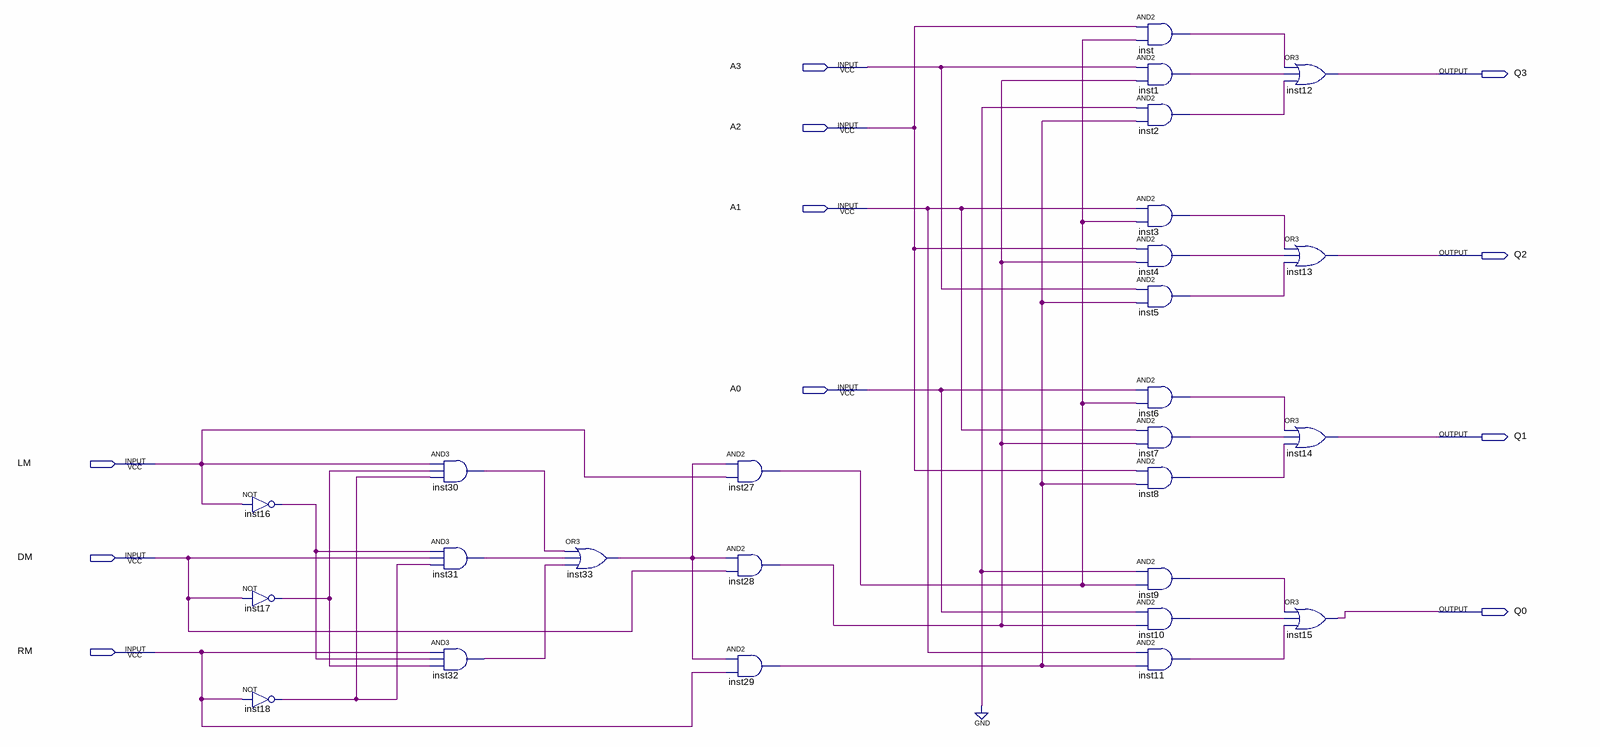
[diagram p0: schematic sheet]
// Quartus schematic shifter-4.bdf as structural Verilog: 26 symbols, 11 pins
module \shifter-4  (
  input  A3,
  input  A2,
  input  A1,
  input  A0,
  input  LM,
  input  DM,
  input  RM,
  output Q3,
  output Q2,
  output Q1,
  output Q0
);

  wire inst1_out, inst2_out, inst3_out, inst4_out, inst5_out, inst6_out, inst7_out, inst8_out, inst9_out,
       inst10_out, inst11_out, inst16_out, inst17_out, inst18_out, inst27_out, inst28_out, inst29_out,
       inst30_out, inst31_out, inst32_out, inst33_out, inst_out;

  not inst16 (inst16_out, LM);
  not inst17 (inst17_out, DM);
  not inst18 (inst18_out, RM);
  and inst30 (inst30_out, LM, inst17_out, inst18_out);
  and inst31 (inst31_out, inst16_out, DM, inst18_out);
  and inst32 (inst32_out, RM, inst16_out, inst17_out);
  or inst33 (inst33_out, inst30_out, inst31_out, inst32_out);
  and inst27 (inst27_out, inst33_out, LM);
  and inst28 (inst28_out, inst33_out, DM);
  and inst29 (inst29_out, inst33_out, RM);
  and inst (inst_out, A2, inst27_out);
  and inst1 (inst1_out, A3, inst28_out);
  and inst2 (inst2_out, 1'b0, inst29_out);
  and inst3 (inst3_out, A1, inst27_out);
  and inst4 (inst4_out, A2, inst28_out);
  and inst5 (inst5_out, A3, inst29_out);
  and inst6 (inst6_out, A0, inst27_out);
  and inst7 (inst7_out, A1, inst28_out);
  and inst8 (inst8_out, A2, inst29_out);
  and inst9 (inst9_out, 1'b0, inst27_out);
  and inst10 (inst10_out, A0, inst28_out);
  and inst11 (inst11_out, A1, inst29_out);
  or inst12 (Q3, inst_out, inst1_out, inst2_out);
  or inst13 (Q2, inst3_out, inst4_out, inst5_out);
  or inst14 (Q1, inst6_out, inst7_out, inst8_out);
  or inst15 (Q0, inst9_out, inst10_out, inst11_out);
endmodule
